# Altium schematic sheet Power_Supply.SchDoc: Power Supply
size A4; CompanyName: HEIG-VD; Organization: Institut d'Automatisation Industrielle; SheetNumber: 2; SheetTotal: 6; SheetFormat: A4; CurrentTime: 6; CurrentDate: 5; DocumentFullPathAndName: 8; DocumentName: 9; ModifiedDate: 13; ProjectName: <projet>
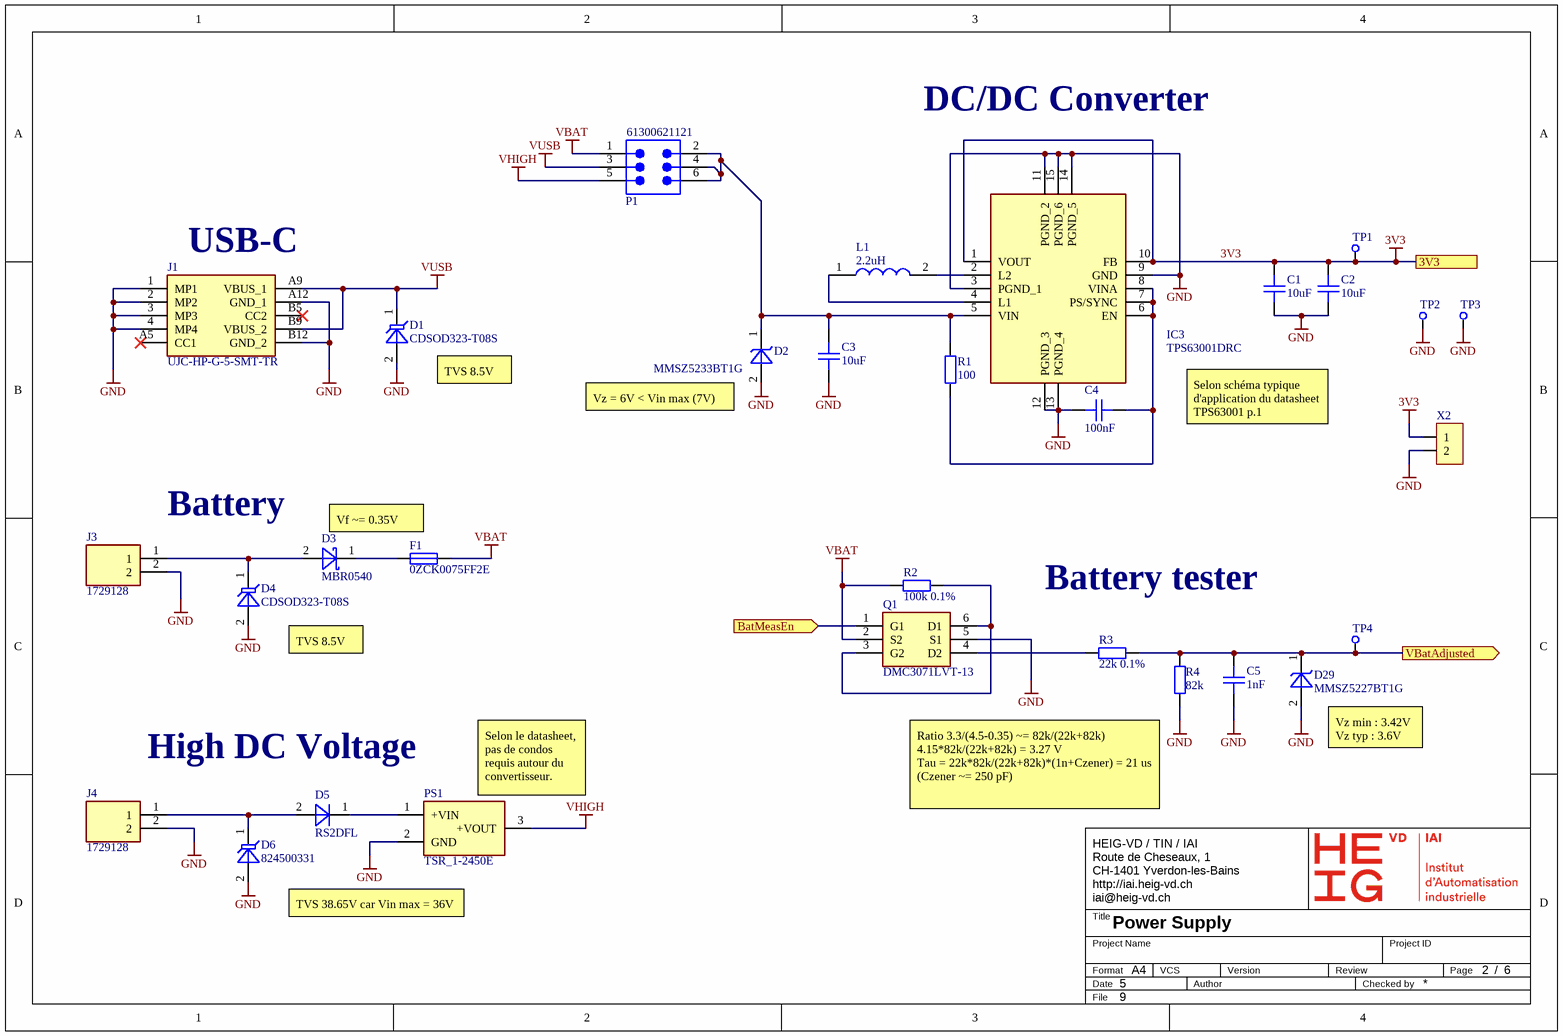
[diagram p0: Power_Supply.SchDoc]

## Parts
C1  10uF  [CAPC3216X18N]
C2  10uF  [CAPC3216X18N]
C3  10uF  [CAPC3216X18N]
C4  100nF  [CAPC1005X05N]
C5  1nF  [CAPC1005X05N]
D1  CDSOD323-T08S  [SODFL250X110-2N]
D2  MMSZ5233BT1G  [SOD3717X135]
D3  MBR0540  [SODFL371X135-2N]
D4  CDSOD323-T08S  [SODFL250X110-2N]
D5  RS2DFL  [SODFL375X120-2N]
D6  824500331  [DIOM4227X25N]
D29  MMSZ5227BT1G  [SOD3717X135]
F1  0ZCK0075FF2E  [RESC2012X05N]
IC3  TPS63001DRC  [TPS63002DRCT]
J1  UJC-HP-G-5-SMT-TR  [UJCHPG5SMTTR]
J3  1729128  [1729128]
J4  1729128  [1729128]
L1  2.2uH  [LPS3015]
P1  61300621121  [61300621121]
PS1  TSR_1-2450E  [TSR12450E]
Q1  DMC3071LVT-13  [SOT95P280X100-6N]
R1  100  [RESC1005X04N]
R2  100k 0.1%  [RESC1608X04N]
R3  22k 0.1%  [RESC1005X04N]
R4  82k  [RESC3216X06N]
TP1  ICT Test Point - TH Round Pad  [TPICTTH09N]  (value not drawn)  (no BOM)
TP2  ICT Test Point - TH Round Pad  [TPICTTH09N]  (value not drawn)  (no BOM)
TP3  ICT Test Point - TH Round Pad  [TPICTTH09N]  (value not drawn)  (no BOM)
TP4  ICT Test Point - TH Round Pad  [TPICTTH09N]  (value not drawn)  (no BOM)
X2  CONN HEADER VERT 2POS 2.54MM  [CONN HEADER VERT 2POS 2.54MM]  (value not drawn)

## Ports
3V3, BatMeasEn (in), VBatAdjusted (out)

## Nets
3V3: C1.2 C2.2 IC3.1(VOUT) IC3.10(FB) TP1.1 X2.1 ; port 3V3
GND: C1.1 C2.1 C3.1 C4.1 C5.1 D1.2(A) D2.2(A) D4.2(A) D6.2(A) D29.2(A) IC3.3(PGND_1) IC3.9(GND) IC3.11(PGND_2) IC3.12(PGND_3) IC3.13(PGND_4) IC3.14(PGND_5) IC3.15(PGND_6) J1.1(MP1) J1.2(MP2) J1.3(MP3) J1.4(MP4) J1.A12(GND_1) J1.B12(GND_2) J3.2 J4.2 PS1.2(GND) Q1.5(S1) R4.1 TP2.1 TP3.1 X2.2
VBAT: F1.2 P1.1 Q1.2(S2) R2.2
VHIGH: P1.5 PS1.3(+VOUT)
VUSB: D1.1(K) J1.A9(VBUS_1) J1.B9(VBUS_2) P1.3
BatMeasEn: Q1.1(G1) ; port BatMeasEn
VBatAdjusted: C5.2 D29.1(K) R3.2 R4.2 TP4.1 ; port VBatAdjusted
NetC3_2: C3.2 D2.1(K) IC3.5(VIN) P1.2 P1.4 P1.6 R1.2
NetC4_2: C4.2 IC3.6(EN) IC3.7(PS/SYNC) IC3.8(VINA) R1.1
NetD3_1: D3.1(K) F1.1
NetD3_2: D3.2(A) D4.1(K) J3.1
NetD5_1: D5.1(K) PS1.1(+VIN)
NetD5_2: D5.2(A) D6.1(K) J4.1
NetIC3_2: IC3.2(L2) L1.2
NetIC3_4: IC3.4(L1) L1.1
NetQ1_3: Q1.3(G2) Q1.6(D1) R2.1
NetQ1_4: Q1.4(D2) R3.1

Not connected (* = marked no-connect by the designer): J1 A5(CC1)* B5(CC2)*

## Notes on the sheet
- DC/DC Converter
- (near J1) USB-C
- (near D1) TVS 8.5V
- (near D2) Vz = 6V < Vin max (7V)
- Selon schéma typique d'application du datasheet TPS63001 p.1
- Battery
- Vf ~= 0.35V
- TVS 8.5V
- Battery tester
- High DC Voltage
- (near PS1) Selon le datasheet, pas de condos requis autour du convertisseur.
- (near D29) Vz min : 3.42V
  Vz typ : 3.6V
- (near R4) Ratio 3.3/(4.5-0.35) ~= 82k/(22k+82k)
  4.15*82k/(22k+82k) = 3.27 V
  Tau = 22k*82k/(22k+82k)*(1n+Czener) = 21 us
  (Czener ~= 250 pF)
- TVS 38.65V car Vin max = 36V
- Title
- HEIG-VD / TIN / IAI
  Route de Cheseaux, 1
  CH-1401 Yverdon-les-Bains
  http://iai.heig-vd.ch
  iai@heig-vd.ch
- Format
- Date
- Project Name
- VCS
- Author
- Version
- Review
- Checked by
- Project ID
- Page
- /
- File

## Library data of the parts
C1 C2 = CMP-0001778-4: 10 µF ±10% 50V Ceramic Capacitor X7R 1206 (3216 Metric); Value: 10µF; Max Operating Temperature: 125°C; Mounting Technology: Surface Mount; RoHS Compliant: Yes; Min Operating Temperature: -55°C; Temperature Coefficient: X7R; Tolerance: 10%; Voltage Rating: 50V; Case/Package: 1206 (3216 Metric)
C3 = CMP-0001778-4: 10 µF ±10% 50V Ceramic Capacitor X7R 1206 (3216 Metric); Manufacturer_Name: Samsung Electro-Mechanics; Manufacturer_Part_Number: CL31B106KBHNNNE; Value: 10µF; Max Operating Temperature: 125°C; Mounting Technology: Surface Mount; RoHS Compliant: Yes; Min Operating Temperature: -55°C; Temperature Coefficient: X7R; Tolerance: 10%; Voltage Rating: 50V; Case/Package: 1206 (3216 Metric); Mouser Part Number: 187-CL31B106KBHNNNE
C4 = CMP-0003371-1: 100nF 10% 50V Ceramic Capacitor X8L 0402 (1005 Metric); Value: 100nF; Max Operating Temperature: 150°C; Case/Package: 0402 (1005 Metric); Temperature Coefficient: X8L; Mounting Technology: Surface Mount; Voltage Rating: 50V; Min Operating Temperature: -55°C; RoHS Compliant: Yes; Tolerance: 10%
C5 = CMP-0003402-1: 1nF 20% 50V Ceramic Capacitor X7R 0402 (1005 Metric); Temperature Coefficient: X7R; Case/Package: 0402 (1005 Metric); Tolerance: 20%; Max Operating Temperature: 125°C; Value: 1nF; Voltage Rating: 50V; RoHS Compliant: Yes; Min Operating Temperature: -55°C; Mounting Technology: Surface Mount
D1 = CMP-0002421-1: TVS Diode, 500W, 8V V(RWM), Unidirectional, 1 Element, 16.9V (Typ) Clamp 34A (8/20µs) Ipp Surface Mount SOD-323; Manufacturer_Name: Bourns; Manufacturer_Part_Number: CDSOD323-T08SC; Breakdown Voltage: 8.5V; Type: Zener; Mounting Technology: Surface Mount; Peak Pulse Current: 34A; Reverse Standoff Voltage: 8V; Clamping Voltage @ Ipp: 16.9V; RoHS Compliant: Yes; Max Operating Temperature: 150°C; Min Operating Temperature: -55°C; Case/Package: SOD-323; Mouser Part Number: 652-CDSOD323-T08SC
D2 = CMP-0005477-4: Zener Diode 6V 500 mW ±5% Surface Mount SOD-123; Impedance: 7; Power: 500mW; Forward Voltage: 900mV; Mounting Technology: Surface Mount; Case/Package: SOD-123; Min Operating Temperature: -55°C; Tolerance: 5%; Zener Voltage: 6V; Max Operating Temperature: 155°C; RoHS Compliant: Yes
D3 = CMP-0001774-4: DIODE SCHOTTKY 40V 500MA SOD123; Forward Voltage: 550mV; Reverse Recovery Time: 500ns; Power Dissipation: 410mW; Mounting Technology: Surface Mount; Case/Package: SOD123; Min Operating Temperature: -55°C; DC Reverse Voltage: 40V; Forward Current: 500mA; RoHS Compliant: Yes; Max Operating Temperature: 150°C
D4 = CMP-0002421-1: TVS Diode, 500W, 8V V(RWM), Unidirectional, 1 Element, 16.9V (Typ) Clamp 34A (8/20µs) Ipp Surface Mount SOD-323; Breakdown Voltage: 8.5V; Type: Zener; Mounting Technology: Surface Mount; Peak Pulse Current: 34A; Reverse Standoff Voltage: 8V; Clamping Voltage @ Ipp: 16.9V; RoHS Compliant: Yes; Max Operating Temperature: 150°C; Min Operating Temperature: -55°C; Case/Package: SOD-323
D5 = CMP-0002644-1: Rectifier Diode, 1 Phase, 1 Element, 2A, 200V V(RRM), Silicon; Power Dissipation: 2.6W; Forward Voltage: 1.3V; Reverse Recovery Time: 150ns; Max Operating Temperature: 150°C; DC Reverse Voltage: 200V; RoHS Compliant: Yes; Mounting Technology: Surface Mount; Case/Package: SMA; Min Operating Temperature: -55°C; Forward Current: 2A
D6 = CMP-0005814-3: Trans Voltage Suppressor Diode, 400W, 33V V(RWM), Unidirectional; Peak Pulse Current: 7.5A; Clamping Voltage @ Ipp: 53.3V; Breakdown Voltage: 38.65V; Type: Zener; Max Operating Temperature: 150°C; Case/Package: DO-214AC; Min Operating Temperature: -65°C; Mounting Technology: Surface Mount; Reverse Standoff Voltage: 33V; RoHS Compliant: Yes
D29 = CMP-0005471-4: Zener Diode 3.6V 500 mW ±5% Surface Mount SOD-123; Forward Voltage: 900mV; Power: 500mW; Impedance: 24; Mounting Technology: Surface Mount; RoHS Compliant: Yes; Tolerance: 5%; Max Operating Temperature: 155°C; Case/Package: SOD-123; Min Operating Temperature: -55°C; Zener Voltage: 3.6V
F1 = CMP-0002366-7: Polymeric PTC Resettable Fuse 6V 750 mA Ih Surface Mount 0805 (2012 Metric), Concave; AC Voltage Rating: 12V; Breaking Capacity @ Rated Voltage: 40A; Current Rating: 750mA; Response Time: 200ms; DC Voltage Rating: 6V; Max Operating Temperature: -40°C; RoHS Compliant: Yes; Case/Package: 0805 (2012 Metric); Min Operating Temperature: 85°C; Mounting Technology: Surface Mount
IC3 = TPS63001DRC: Integrated Circuit; Manufacturer_Name: Texas Instruments; Datasheet Link: https://www.ti.com/lit/ds/symlink/tps63002.pdf?HQS=dis-mous-null-mousermode-dsf-pf-null-wwe&ts=1627981401743&ref_url=https%253A%252F%252Fwww.mouser.cn%252F; Height: 1mm; Manufacturer_Part_Number: TPS63001DRC
J1 = UJC-HP-G-5-SMT-TR: Connector; Manufacturer_Name: Same Sky; Datasheet Link: https://www.sameskydevices.com/product/resource/supplyframepdf/ujc-hp-g-5-smt-tr.pdf; Height: 3.36mm; Manufacturer_Part_Number: UJC-HP-G-5-SMT-TR; Mouser Part Number: 179-UJCHPG5SMTTR; Mouser Price/Stock: https://www.mouser.co.uk/ProductDetail/Same-Sky/UJC-HP-G-5-SMT-TR?qs=vvQtp7zwQdPGKwfb4jpehQ%3D%3D; Arrow Part Number: UJC-HP-G-5-SMT-TR; Arrow Price/Stock: https://www.arrow.com/en/products/ujc-hp-g-5-smt-tr/same-sky-(formerly-cui-devices)?utm_currency=USD&region=nac
J3 J4 = 1729128: Connector; Manufacturer_Name: Phoenix Contact; Datasheet Link: http://www.phoenixcontact.net/product/1729128; Height: 10.15mm; Manufacturer_Part_Number: 1729128; Mouser Part Number: 651-1729128; Mouser Price/Stock: https://www.mouser.co.uk/ProductDetail/Phoenix-Contact/1729128?qs=GFUSqQMLmmnCBVBY3dts9w%3D%3D; Arrow Part Number: 1729128; Arrow Price/Stock: https://www.arrow.com/en/products/1729128/phoenix-contact?region=nac; System: Connector
L1 = LPS3015-222MLB: Inductor / LPS3015-222MLB; Manufacturer_Name: COILCRAFT; Datasheet Link: https://www.mouser.de/datasheet/2/597/lps3015-270734.pdf; Manufacturer_Part_Number: LPS3015-222MLB; Mouser Part Number: 994-LPS3015-222MLB; Mouser Price/Stock: https://www.mouser.co.uk/ProductDetail/Coilcraft/LPS3015-222MLB?qs=zCSbvcPd3pZ6eDikEPAG6g%3D%3D
P1 = 61300621121: WR-PHD Pin Header, THT, Vertical, pitch 2.54mm, 2 Row, 6P; Manufacturer: Wurth Elektronik; Contact Resistance: 20mOhm; Rated Current: 3A; Working Voltage: 250V; Withstanding Voltage: 500V; Manufacturer Part Number: 61300621121; Category: Board-to-Board Connectors; Match Code: WR-PHD; ComponentLink1Description: Website Link; ComponentLink1URL: https://www.we-online.com/redexpert/article/61300621121?ad; ComponentLink2Description: Datasheet Link; ComponentLink2URL: https://www.we-online.com/redexpert/spec/61300621121?ad; Mount: Through Hole; Operating Temperature Max: 105°C; Operating Temperature Min: -40°C; Packaging: Bag; Gender: Pin Header; Number of Pins: 6; Number of Rows: 2; Orientation: Vertical; Pitch: 2.54mm
PS1 = TSR_1-2450E: DC/DC Converter / 7-36 V -> 5V; Manufacturer_Name: Traco Power; Manufacturer_Part_Number: TSR 1-2450E; Datasheet Link: https://tracopower.com/tsr1e-datasheet/; Height: 10.6mm; Mouser Part Number: 495-TSR1-2450E; Mouser Price/Stock: https://www.mouser.co.uk/ProductDetail/TRACO-Power/TSR-1-2450E?qs=vmHwEFxEFR%2FlQnbAtEoeVA%3D%3D
Q1 = DMC3071LVT-13: MOSFET Pair (N/P-Channel); Manufacturer_Name: Diodes Incorporated; Datasheet Link: https://www.diodes.com//assets/Datasheets/DMC3071LVT.pdf; Height: 1mm; Manufacturer_Part_Number: DMC3071LVT-13; Mouser Part Number: 621-DMC3071LVT-13; Mouser Price/Stock: https://www.mouser.co.uk/ProductDetail/Diodes-Incorporated/DMC3071LVT-13?qs=wUXugUrL1qxBKRufN84dSg%3D%3D; Arrow Part Number: DMC3071LVT-13; Arrow Price/Stock: https://www.arrow.com/en/products/dmc3071lvt-13/diodes-incorporated
R1 = CMP-0004701-2: 100 Ohms 0402 / CRCW0402100RFKEDC; Power: 62.5mW; Temperature Coefficient: 800ppm/°C; Resistor Series: E24; Tolerance: 1%; Voltage Rating: 50V; Value: 0.1; Mounting Technology: Surface Mount; Max Operating Temperature: 155°C; Case/Package: 0402 (1005 Metric); Min Operating Temperature: -55°C; RoHS Compliant: Yes
R2 = CMP-0004445-2: 100 kOhms ±0.1% 0.1W, 1/10W Chip Resistor 0603 (1608 Metric) Thin Film; Resistor Series: E96; Temperature Coefficient: 25ppm/°C; Power: 100mW; Voltage Rating: 75V; Mounting Technology: Surface Mount; RoHS Compliant: Yes; Value: 100k; Min Operating Temperature: -55°C; Max Operating Temperature: 155°C; Tolerance: 0.1%; Case/Package: 0603 (1608 Metric)
R3 = CMP-0004081-2: 22 kOhms ±0.1% 0.063W, 1/16W Chip Resistor 0402 (1005 Metric) Thin Film / RT0402BRD0722KL; Power: 63mW; Resistor Series: E24; Voltage Rating: 50V; Temperature Coefficient: 25ppm/°C; RoHS Compliant: Yes; Tolerance: 0.1%; Max Operating Temperature: 155°C; Mounting Technology: Surface Mount; Value: 22k; Min Operating Temperature: -55°C; Case/Package: 0402 (1005 Metric)
R4 = CMP-0006715-1: 82 kOhms ±1% 0.25W, 1/4W Chip Resistor 1206 (3216 Metric) Moisture Resistant Thick Film / RC1206FR-0782KL; Resistor Series: E24; Voltage Rating: 200V; Temperature Coefficient: 100ppm/°C; Power: 250mW; RoHS Compliant: Yes; Min Operating Temperature: -55°C; Max Operating Temperature: 155°C; Mounting Technology: Surface Mount; Tolerance: 1%; Case/Package: 1206 (3216 Metric); Value: 82k
TP1-TP4 = CMP-0005616-2: Through hole test point round pad for in-circuit test; Mounting Technology: Not Applicable; Max Operating Temperature: 125°C; RoHS Compliant: Yes; Colour: No Colour; Case/Package: No Case; Min Operating Temperature: -55°C; NetName: NetName
X2 = CMP-0002184-3: Connector Header Through Hole 2 position 0.100" (2.54mm); Number of Positions: 2; Contact Length: 11.54mm; Shrouding: Unshrouded; Row Spacing: 0mm; Current Rating: 3A; RoHS Compliant: Yes; Pitch: 2.54mm; Max Operating Temperature: 105°C; Mounting Technology: Through Hole; Min Operating Temperature: -40°C; Contact Shape: Square; Number of Rows: 1; System: Connector